# Altium project WSBD_FlexBoard.PrjPcb
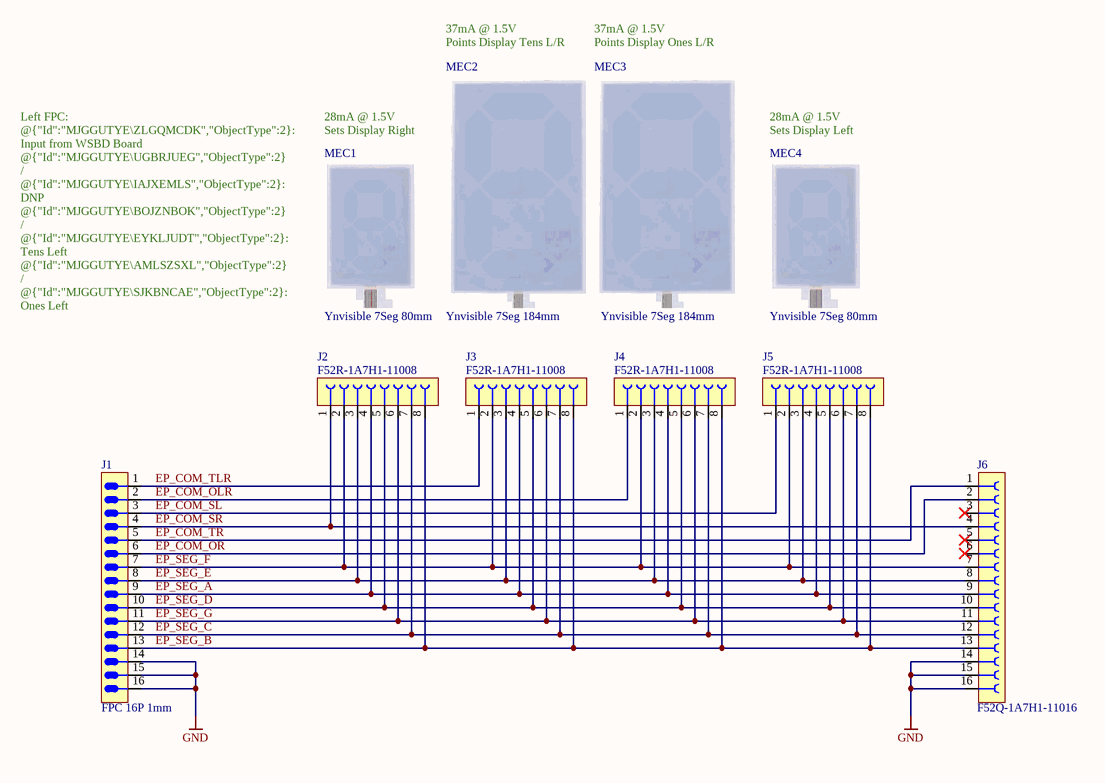
[diagram p0: Overview.SchDoc]
Author: Joel Schaller; Project: Wireless ScoreBoard; Revision: 1.0; SubProject: Display FPC
1 sheet, 10 parts. Net scope: global (net labels, ports and power ports of the same name join across sheets).
Board file: WSBD_FlexBoard.PcbDoc

## Sheet Overview.SchDoc
size A4; SheetNumber: 1; SheetTotal: 1; Module: Overview

### Parts
J1  FPC 16P 1mm  [6pin FPC 1mm]  (no BOM)
J2  F52R-1A7H1-11008  [F52R-1A7H1-11008]
J3  F52R-1A7H1-11008  [F52R-1A7H1-11008]
J4  F52R-1A7H1-11008  [F52R-1A7H1-11008]
J5  F52R-1A7H1-11008  [F52R-1A7H1-11008]
J6  F52Q-1A7H1-11016  [F52Q-1A7H1-11016]
MEC1  Ynvisible 7Seg 80mm  (mechanical)
MEC2  Ynvisible 7Seg 184mm  (mechanical)
MEC3  Ynvisible 7Seg 184mm  (mechanical)
MEC4  Ynvisible 7Seg 80mm  (mechanical)

### Nets
GND: J1.14 J1.15 J1.16 J6.14 J6.15 J6.16
EP_COM_OLR: J1.2 J4.1
EP_COM_OR: J1.6 J6.2
EP_COM_SL: J1.3 J5.1
EP_COM_SR: J1.4 J2.1 J6.4
EP_COM_TLR: J1.1 J3.1
EP_COM_TR: J1.5 J6.1
EP_SEG_A: J1.9 J2.4 J3.4 J4.4 J5.4 J6.9
EP_SEG_B: J1.13 J2.8 J3.8 J4.8 J5.8 J6.13
EP_SEG_C: J1.12 J2.7 J3.7 J4.7 J5.7 J6.12
EP_SEG_D: J1.10 J2.5 J3.5 J4.5 J5.5 J6.10
EP_SEG_E: J1.8 J2.3 J3.3 J4.3 J5.3 J6.8
EP_SEG_F: J1.7 J2.2 J3.2 J4.2 J5.2 J6.7
EP_SEG_G: J1.11 J2.6 J3.6 J4.6 J5.6 J6.11

Not connected (* = marked no-connect by the designer): J6 3* 5* 6*

### Notes on the sheet
- Points Display Tens L/R
- 37mA @ 1.5V
- Points Display Ones L/R
- Sets Display Right
- 28mA @ 1.5V
- Sets Display Left
- Left FPC:
  @{"Id":"MJGGUTYE\ZLGQMCDK","ObjectType":2}: Input from WSBD Board
  @{"Id":"MJGGUTYE\UGBRJUEG","ObjectType":2} / @{"Id":"MJGGUTYE\IAJXEMLS","ObjectType":2}: DNP
  @{"Id":"MJGGUTYE\BOJZNBOK","ObjectType":2} / @{"Id":"MJGGUTYE\EYKLJUDT","ObjectType":2}: Tens Left
  @{"Id":"MJGGUTYE\AMLSZSXL","ObjectType":2} / @{"Id":"MJGGUTYE\SJKBNCAE","ObjectType":2}: Ones Left
  @{"Id":"MJGGUTYE\ONDZXFXB","ObjectType":2} / @{"Id":"MJGGUTYE\HVNKOQWH","ObjectType":2}: Sets Left
  @{"Id":"MJGGUTYE\GOHXRSWW","ObjectType":2}: Output to right FPC
  Right FPC:
  @{"Id":"MJGGUTYE\ZLGQMCDK","ObjectType":2} : Input from left FPC
  @{"Id":"MJGGUTYE\UGBRJUEG","ObjectType":2} / @{"Id":"MJGGUTYE\IAJXEMLS","ObjectType":2} : Sets Right
  @{"Id":"MJGGUTYE\BOJZNBOK","ObjectType":2} / @{"Id":"MJGGUTYE\EYKLJUDT","ObjectType":2} : Tens Right
  @{"Id":"MJGGUTYE\AMLSZSXL","ObjectType":2} / @{"Id":"MJGGUTYE\SJKBNCAE","ObjectType":2} : Ones Right
  @{"Id":"MJGGUTYE\ONDZXFXB","ObjectType":2} / @{"Id":"MJGGUTYE\HVNKOQWH","ObjectType":2} : DNP
  @{"Id":"MJGGUTYE\GOHXRSWW","ObjectType":2} : DNP
- Module:
- Size:
- A4
- Revision:
- Sheet:
- Project:
- /
- Sub-Project:
- Date:
- Author:
- File:

### Library data of the parts
J1 = CMP-03085-5: CONN FPC 16POS 1mm
J2-J5 = CMP-03084-2: CONN FPC TOP 8POS 1mm; Manufacturer: Amphenol ICC (FCI); Manufacturer Part Number: F52R-1A7H1-11008; Supplier: Digi-Key; Supplier Part Number: 609-F52R-1A7H1-11008CT-ND; Supplier2: Mouser; Supplier2 Part Number: 649-F52R-1A7H1-11008
J6 = CMP-03079-1: CONN FPC TOP 16POS 1mm; Manufacturer: Amphenol ICC (FCI); Manufacturer Part Number: F52Q-1A7H1-11016; Supplier: Digi-Key; Supplier Part Number: 609-F52Q-1A7H1-11016CT-ND; Supplier2: Mouser; Supplier2 Part Number: 649-F52Q-1A7H1-11016
MEC1 MEC4 = CMP-03087-2: EMECH SINGLE EPAPER 7SEG 80MM; Manufacturer Part Number: LARGE E-PAPER DISPLAY – SINGLE DIGIT 80MM; Manufacturer: Ynvisible; Supplier: Ynvisible Shop; Supplier Part Number: SINGLE DIGIT 80MM
MEC2 MEC3 = CMP-03086-2: EMECH SINGLE EPAPER 7SEG 184MM; Manufacturer: Ynvisible; Manufacturer Part Number: LARGE E-PAPER DISPLAY – SINGLE DIGIT 184MM; Supplier: Ynvisible Shop; Supplier Part Number: SINGLE DIGIT 184MM